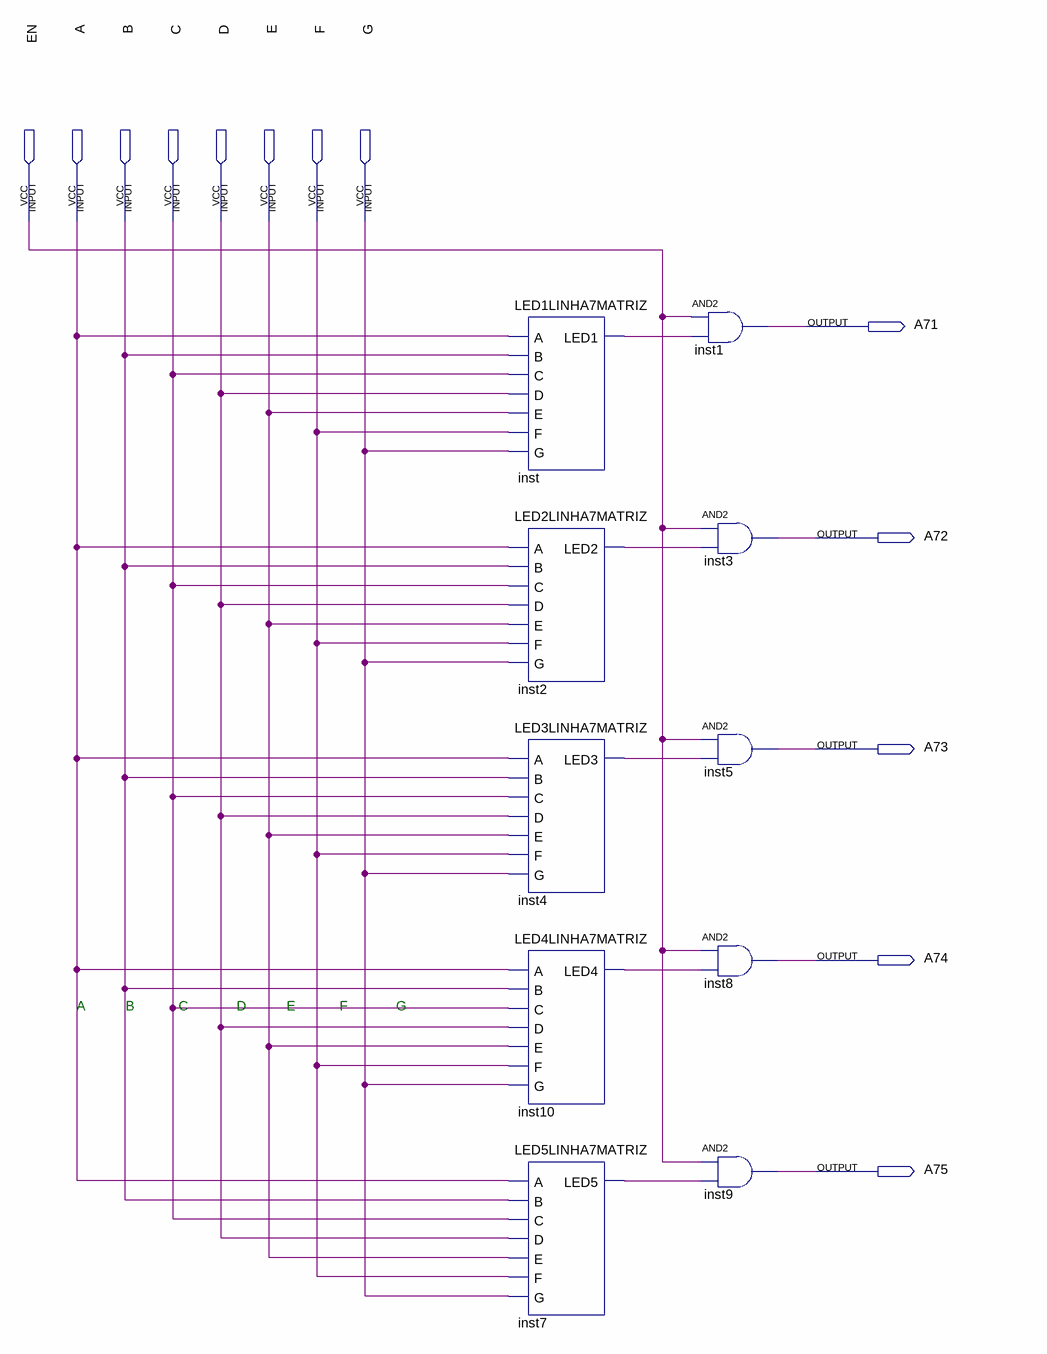
[diagram p0: schematic sheet]
// Quartus schematic Linha7.bdf as structural Verilog: 10 symbols, 13 pins
module Linha7 (
  input  EN,
  input  A,
  input  B,
  input  C,
  input  D,
  input  E,
  input  F,
  input  G,
  output A71,
  output A72,
  output A73,
  output A74,
  output A75
);

  wire inst2_led2, inst4_led3, inst7_led5, inst10_led4, inst_led1;

  LED1LINHA7MATRIZ inst (.A(A), .B(B), .C(C), .D(D), .E(E), .F(F), .G(G), .LED1(inst_led1));
  LED2LINHA7MATRIZ inst2 (.A(A), .B(B), .C(C), .D(D), .E(E), .F(F), .G(G), .LED2(inst2_led2));
  LED3LINHA7MATRIZ inst4 (.A(A), .B(B), .C(C), .D(D), .E(E), .F(F), .G(G), .LED3(inst4_led3));
  LED4LINHA7MATRIZ inst10 (.A(A), .B(B), .C(C), .D(D), .E(E), .F(F), .G(G), .LED4(inst10_led4));
  LED5LINHA7MATRIZ inst7 (.A(A), .B(B), .C(C), .D(D), .E(E), .F(F), .G(G), .LED5(inst7_led5));
  and inst1 (A71, EN, inst_led1);
  and inst3 (A72, EN, inst2_led2);
  and inst5 (A73, EN, inst4_led3);
  and inst8 (A74, EN, inst10_led4);
  and inst9 (A75, EN, inst7_led5);

  // Notes on the sheet:
  //   A          B           C            D          E           F            G
endmodule
